# Altium schematic sheet Schematic.SchDoc
size A; SheetNumber: 1; SheetTotal: 1; SPICEModelCacheXZDIDKGW: <root> / <DocumentId>XZDIDKGW</DocumentId> / <CacheFrame Number="0"> / <Model Name="mcp6001" Kind="CKT"> / <Text>.SUBCKT MCP6001 1 2 3 4 5 / *               | | | | | / *               | | | | Output / *               | | | Negative Supply / *               | | Positive Supply / *               | Inverting Input / *               Non-inverting Input / * / ******************************************************************************** / * Software License Agreement                                                   * / *                                                                              * / * The software supplied herewith by Microchip Technology Incorporated (the     * / * "Company") is intended and supplied to you, the Company's customer, for use  * / * soley and exclusively on Microchip products.                                 * / *                                                                              * / * The software is owned by the Company and/or its supplier, and is protected   * / * under applicable copyright laws. All rights are reserved. Any use in         * / * violation of the foregoing restrictions may subject the user to criminal     * / * sanctions under applicable laws, as well as to civil liability for the       * / * breach of the terms and conditions of this license.                          * / *                                                                              * / * THIS SOFTWARE IS PROVIDED IN AN "AS IS" CONDITION. NO WARRANTIES, WHETHER    * / * EXPRESS, IMPLIED OR STATUTORY, INCLUDING, BUT NOT LIMITED TO, IMPLIED        * / * WARRANTIES OF MERCHANTABILITY AND FITNESS FOR A PARTICULAR PURPOSE APPLY TO  * / * THIS SOFTWARE. THE COMPANY SHALL NOT, IN ANY CIRCUMSTANCES, BE LIABLE FOR    * / * SPECIAL, INCIDENTAL OR CONSEQUENTIAL DAMAGES, FOR ANY REASON WHATSOEVER.     * / ******************************************************************************** / * / * Macromodel for the MCP6001/2/4 op amp family: / *   MCP6001, MCP6001R, MCP6001U, MCP6002, MCP6004 / * / * Revision History: / *   REV A: 21-Jun-02, Created model / *   REV B: 16-Jul-02, Improved output stage / *   REV C: 03-Jan-03, Added MCP6001 / *   REV D: 19-Aug-06, Added over temperature, improved output stage, / *                     fixed overdrive recovery time / *   REV E: 27-Jul-07, Updated output impedance for better model stability w/cap load / *   REV F: 09-Jul-12, Added MCP6001R, MCP6001U / * / * Recommendations: / *   Use PSPICE (other simulators may require translation) / *   For a quick, effective design, use a combination of: data sheet / *     specs, bench testing, and simulations with this macromodel / *   For high impedance circuits, set GMIN=100F in .OPTIONS / * / * Supported: / *   Typical performance for temperature range (-40 to 125) degrees Celsius / *   DC, AC, Transient, and Noise analyses. / *   Most specs, including: offsets, DC PSRR, DC CMRR, input impedance, / *     open loop gain, voltage ranges, supply current, ... , etc. / *   Temperature effects for Ibias, Iquiescent, Iout short circuit / *   current, Vsat on both rails, Slew Rate vs. Temp and P.S. / * / * Not Supported: / *   Some Variation in specs vs. Power Supply Voltage / *   Monte Carlo (Vos, Ib), Process variation / *   Distortion (detailed non-linear behavior) / *   Behavior outside normal operating region / * / * Input Stage / V10  3 10 -500M / R10 10 11 6.90K / R11 10 12 6.90K / C11 11 12 0.2p / C12 1  0 6.00P / E12 71 14 POLY(4) 20 0 21 0 26 0 27 0   1.00M 20.1 20.1 1 1 / G12 1 0 62 0 1m / M12 11 14 15 15 NMI L=2.00U W=42.0U / M14 12  2 15 15 NMI L=2.00U W=42.0U / G14 2 0 62 0 1m / C14  2  0 6.00P / I15 15  4 50.0U / V16 16  4 -300M / GD16 16 1 TABLE {V(16,1)} ((-100,-1p)(0,0)(1m,1n)(2m,1m)(3m,1)) / V13  3 13 -300M / GD13 2 13 TABLE {V(2,13)} ((-100,-1p)(0,0)(1m,1n)(2m,1m)(3m,1)) / R70 1 0 20.6T / R71 2 0 20.6T / R72 1 2 20T / I80 1 2 0.5p / * / * Noise, PSRR, and CMRR / I20 21 20 423U / D20 20  0 DN1 / D21  0 21 DN1 / G26  0 26 POLY(1) 3 4   110U -49U / R26 26  0 1 / G27  0 27 POLY(2) 1 0 2 0   -440U 39.7U 39.7U / R27 27  0 1 / * / * Open Loop Gain, Slew Rate / G30  0 30 POLY(1) 12 11   0 1 / R30 30  0 1K / G31  0 31 POLY(1) 3 4 86 5.25 / R31 31  0 1 TC=2.8m / GD31 30 31 TABLE {V(30,31)} ((-11,-1)(-10,-10n)(0,0)(1m,1000)) / G32 32  0 POLY(1) 3 4 113.7 3.5 / R32 32  0 1 TC=2.65m / GD32 30 32 TABLE {V(30,32)} ((-1m,-1000)(0,0)(10,10n)(11,1)) / G33 0 33 30 0 1m / R33 33 0 1k / G34  0 34 33 0 425M / R34  34 0 1K / C34  34 0 74U / G37  0 37 34 0 1m / R37  37 0 1K / C37  37 0 41.6P / G38  0 38 37 0 1m / R38  39 0 1K / L38  38 39 100U / E38  35 0 38 0 1 / G35 33 0 TABLE {V(35,3)} ((-1,-1n)(0,0)(16,1n))(16.1,1)) / G36 33 0 TABLE {V(35,4)} ((-16.1,-1)((-16,-1n)(0,0)(1,1n)) / * / * Output Stage / R80 50 0 100MEG / G50 0 50 57 96 2 / R58 57  96 0.50 / R57 57  0 750 / C58  5  0 2.00P / G57  0 57 POLY(3) 3 0 4 0 35 0   0 0.67M 0.67M 1.5M / GD55 55 57 TABLE {V(55,57)} ((-2m,-1)(-1m,-1m)(0,0)(10,1n)) / GD56 57 56 TABLE {V(57,56)} ((-2m,-1)(-1m,-1m)(0,0)(10,1n)) / E55 55  0 POLY(2) 3 0 51 0 -0.7m 1 -40.0M / E56 56  0 POLY(2) 4 0 52 0 1.2m 1 -37.0M / R51 51 0 1k / R52 52 0 1k / GD51 50 51 TABLE {V(50,51)} ((-10,-1n)(0,0)(1m,1m)(2m,1)) / GD52 50 52 TABLE {V(50,52)} ((-2m,-1)(-1m,-1m)(0,0)(10,1n)) / G53  3  0 POLY(1) 51 0  -49U 1M / G54  0  4 POLY(1) 52 0  -49U -1M / * / * Current Limit / G99 96 5 99 0 1 / R98 0 98 1 TC=-2.8M,2.63U / G97 0 98 TABLE { V(96,5) } ((-11.0,-10.0M)(-1.00M,-9.9M)(0,0)(1.00M,9.9M)(11.0,10.0M)) / E97 99 0 VALUE { V(98)*((V(3)-V(4))*359M + 310M)} / D98 4 5 DESD / D99 5 3 DESD / * / * Temperature / Voltage Sensitive IQuiscent / R61 0 61 100 TC 3.11M 4.51U / G61 3 4 61 0 1 / G60 0 61 TABLE {V(3, 4)} / + ((0,0)(900M,0.0106U)(1.00,0.20U)(1.3,0.63U) / + (1.5,0.66U)(1.6,1.06U)(5.5,1.10U)) / * / * Temp Sensitive offset voltage / I73 0 70 DC 1uA / R74 0 70 1 TC=2 / E75 1 71 70 0 1 / * / * Temp Sensistive IBias / I62 0 62 DC 1uA / R62 0 62 REXP 58.2u / * Voltage on R62 used for G12, G14 in input stage / * / * Models / .MODEL NMI NMOS / .MODEL DESD  D   N=1 IS=1.00E-15 / .MODEL DL  D   N=1 IS=1F / .MODEL DN1 D   IS=1P KF=146E-18 AF=1 / .MODEL REXP RES TCE=10.1 / .ENDS MCP6001</Text> / </Model> / </CacheFrame> / </root>
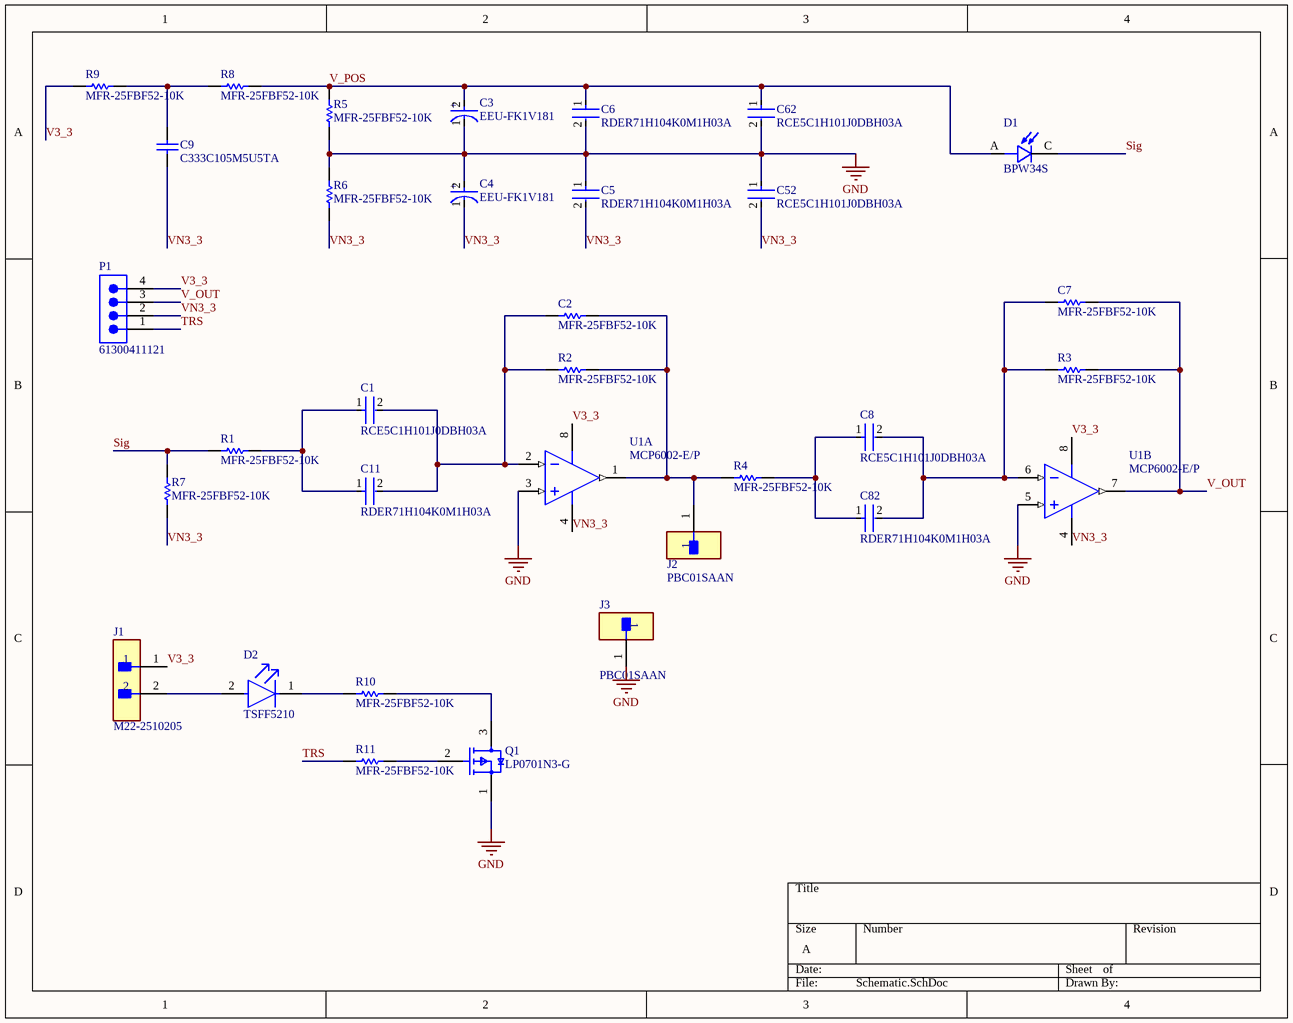
[diagram p0: Schematic.SchDoc]

## Parts
C1  RCE5C1H101J0DBH03A  [FP-RCE0DB-MFG]
C2  MFR-25FBF52-10K  [RESA60-630X240]
C3  EEU-FK1V181  [FP-RAD-TH-D_8_0_5-L_11_5-MFG]
C4  EEU-FK1V181  [FP-RAD-TH-D_8_0_5-L_11_5-MFG]
C5  RDER71H104K0M1H03A  [FP-RDE0M1-MFG]
C6  RDER71H104K0M1H03A  [FP-RDE0M1-MFG]
C7  MFR-25FBF52-10K  [RESA60-630X240]
C8  RCE5C1H101J0DBH03A  [FP-RCE0DB-MFG]
C9  C333C105M5U5TA  [KEMT-C333C105M5U5TA-2]
C11  RDER71H104K0M1H03A  [FP-RDE0M1-MFG]
C52  RCE5C1H101J0DBH03A  [FP-RCE0DB-MFG]
C62  RCE5C1H101J0DBH03A  [FP-RCE0DB-MFG]
C82  RDER71H104K0M1H03A  [FP-RDE0M1-MFG]
D1  BPW34S  [DIO_BPW34S]
D2  TSFF5210  [FP-6_544-5258_09-4-MFG]
J1  M22-2510205  [FP-M22-2510205-MFG]
J2  PBC01SAAN  [FP-PBC01SAAN-MFG]
J3  PBC01SAAN  [FP-PBC01SAAN-MFG]
P1  61300411121  [61300411121]
Q1  LP0701N3-G  [FP-N3-MFG]
R1  MFR-25FBF52-10K  [RESA60-630X240]
R2  MFR-25FBF52-10K  [RESA60-630X240]
R3  MFR-25FBF52-10K  [RESA60-630X240]
R4  MFR-25FBF52-10K  [RESA60-630X240]
R5  MFR-25FBF52-10K  [RESA60-630X240]
R6  MFR-25FBF52-10K  [RESA60-630X240]
R7  MFR-25FBF52-10K  [RESA60-630X240]
R8  MFR-25FBF52-10K  [RESA60-630X240]
R9  MFR-25FBF52-10K  [RESA60-630X240]
R10  MFR-25FBF52-10K  [RESA60-630X240]
R11  MFR-25FBF52-10K  [RESA60-630X240]
U1  MCP6002-E/P  [PDIP300-P8]  (parts A,B of 2)

## Nets
GND: C3.1(C) C4.2(A) C5.1 C6.2 C52.1 C62.2 J3.1 Q1.1(S) R5.1 R6.2 U1.3(VINA+) U1.5(VINB+)
Sig: D1.C R1.1 R7.2
TRS: P1.1 R11.1
V3_3: J1.1 P1.4 R9.1 U1.8(VDD)
V_OUT: C7.2 P1.3 R3.2 U1.7(VOUTB)
V_POS: C3.2(A) C6.1 C62.1 D1.A R5.2 R8.2
VN3_3: C4.1(C) C5.2 C9.1 C52.2 P1.2 R6.1 R7.1 U1.4(VSS)
NetC1_1: C1.1 C11.1 R1.2
NetC1_2: C1.2 C2.1 C11.2 R2.1 U1.2(VINA-)
NetC2_2: C2.2 J2.1 R2.2 R4.1 U1.1(VOUTA)
NetC7_1: C7.1 C8.2 C82.2 R3.1 U1.6(VINB-)
NetC8_1: C8.1 C82.1 R4.2
NetC9_2: C9.2 R8.1 R9.2
NetD2_1: D2.1(C) R10.1
NetD2_2: D2.2(A) J1.2
NetQ1_2: Q1.2(G) R11.2
NetQ1_3: Q1.3(D) R10.2

## Notes on the sheet
- (in symbol CMP-00030-00005-1) +

## Library data of the parts
C1 C8 C52 C62 = CMP-00030-00004-1: Ceramic Capacitor, Multilayer, Ceramic, 50V, 5% +Tol, 5% -Tol, C0G, 30ppm/Cel TC, 0.0001uF, Through Hole Mount, 1410; Reference Standard: AEC-Q200; Value: 100pF; Tolerance  (fill in as +-): 5%; Terminal Pitch: 2.5mm; Min Operating Temperature: -55°C; Width: 2.5mm; Capacitor Type: Ceramic; Packaging: Ammo Pack; Height: 3.5mm; Length: 3.6mm; Rated DC Voltage (URdc): 50V; Package Style: RadialMeter; Case/Package: 1410; Dielectric Material: Ceramic; RoHS Compliant: Yes; Max Operating Temperature: 125°C; Temperature Characteristics Code: C0G; Reach SVHC Compliant: Yes; Pins: 2; Tolerance (fill in as +-): 5%
C2 C7 R1-R11 = CMP-00030-00002-1: Fixed Resistor, Metal Film, 0.25W, 10000ohm, 250V, 1% +/-Tol, -100,100ppm/Cel; Lead Length: 28mm; Power: 250mW; Value: 10kR; Temperature Coefficient: -100100ppm/°C; Lead Diameter: 0.55mm; Package Length: 6.3mm; Pins: 2; JESD-609 Code: e3; Tolerance: 1%; Package Style: AXIAL; Max Operating Temperature: 155°C; RoHS Compliant: Yes; Packaging: Bulk; Construction: Cylindrical; Working Voltage: 250V; Technology: METAL FILM; Reach SVHC Compliant: Yes; Package Shape: Cylindrical; Min Operating Temperature: -55°C; Terminal Finish: Tin; Resistor Type: FIXED RESISTOR
C3 C4 = CMP-00030-00005-1: Aluminum Electrolytic Capacitor, Polarized, Aluminum (wet), 35V, 20% +Tol, 20% -Tol, 180uF, Through Hole Mount; Capacitor Type: Aluminium; Reference Standard: AEC-Q200; Leakage Current: 63uA; Ripple Current: 441mA; Tan Delta: 0.12; Max Operating Temperature: 105°C; Tolerance  (fill in as +-): 20%; Tolerance (fill in as +-): 20%; Min Operating Temperature: -55°C; Reach SVHC Compliant: Yes; Pins: 2; Polarity: Polarized; Rated DC Voltage (URdc): 35V; Terminal Pitch: 3.5mm; Packaging: Bulk; Value: 180uF; Package Style: RadialMeter; Dielectric Material: Aluminium; Length: 11.5mm; RoHS Compliant: Yes; Mounting Technology: Through Hole; Termination: Wire; Diameter: 8mm
C5 C6 C11 C82 = CMP-00030-00006-1: Ceramic Capacitor, Multilayer, Ceramic, 50V, 10% +Tol, 10% -Tol, X7R, 15% TC, 0.1uF, Through Hole Mount, 1610; Value: 100nF; Multilayer: Yes; Packaging: Ammo Pack; Case/Package: 1610; Tolerance (fill in as +-): 10%; Min Operating Temperature: -55°C; Terminal Pitch: 5mm; Tolerance  (fill in as +-): 10%; RoHS Compliant: Yes; Package Shape: Rectangular; Max Operating Temperature: 125°C; Package Style: RadialMeter; Dielectric Material: Ceramic; Length: 4mm; Reach SVHC Compliant: Yes; Mounting Technology: Through Hole; Capacitor Type: Ceramic; Height: 3.5mm; Termination: Wire; Pins: 2; Rated DC Voltage (URdc): 50V; Temperature Characteristics Code: X7R; Width: 2.5mm
C9 = CMP-00030-00003-1: Ceramic Capacitor, Multilayer, Ceramic, 50V, 20% +Tol, 20% -Tol, Z5U, -56/+22% TC, 1uF, Through Hole Mount; Multilayer: Yes; Rated DC Voltage (URdc): 50V; Tolerance  (fill in as +-): 20%; Reach SVHC Compliant: Yes; Packaging: Bulk; Max Operating Temperature: 85°C; Dielectric Material: Ceramic; Mounting Technology: Through Hole; Value: 1uF; Terminal Pitch: 5.08mm; JESD-609 Code: e3; Height: 9.91mm; RoHS Compliant: Yes; Min Operating Temperature: 10°C; Width: 3.81mm; Pins: 2; Terminal Finish: Nickel; Package Shape: Rectangular; Capacitor Type: Ceramic; Termination: Wire; Length: 7.62mm; Case/Package: 3015; Package Style: RadialMeter; Temperature Characteristics Code: Z5U; Tolerance (fill in as +-): 20%
D1 = BPW34S: Photodiode 850nm 20ns 120Â° 2-SMD, Gull Wing; MF: OSRAM Opto; Price: None; Package: DIP-2 Osram; MP: BPW34S; Value: *; Availability: Unavailable; SnapEDA_Link: https://www.snapeda.com/parts/BPW34S/OSRAM%20Opto%20Semiconductors%20Inc./view-part/253768/?ref=snap
D2 = CMP-00030-00011-1: Infrared LED, 5mm, 1-Element, 870nm; Output Power-Nom: 50mW; Forward Voltage: 1.8V; Shape: Round; Spectral Bandwidth: 4E-08nm; Additional Feature: HIGH RELIABILITY; Forward Current: 100mA; Semiconductor Material: GaAlAs; Channels: 1; Viewing Angle: 20°; Reverse Voltage-Max: 5V; Optoelectronic Device Type: INFRARED LED; RoHS Compliant: Yes; Reach SVHC Compliant: Yes; JESD-609 Code: e3; Mounting Technology: Through Hole; Size: 5mm; Min Operating Temperature: -40°C; Max Operating Temperature: 85°C; Terminal Finish: Tin
J1 = CMP-00030-00010-1: Board Connector, 2 Contact(s), 1 Row(s), Male, Straight, 0.079 inch Pitch, Solder Terminal, Black Insulator, Plug; Additional Feature: ROHS COMPLIANT; Number of Rows Loaded: 1; Number of Contacts: 2; Reliability: COMMERCIAL; PCB Contact Pattern: RECTANGULAR; Body Depth: 0.059inch; Reference Standard: UL; IEC Conformance: No; Contact Resistance: 20mR; Dielectric Withstanding Voltage (AC): 650V; Option: General Purpose; Durability: 300Cycles; Rated Current (Signal): 1A; Contact Style: SQ PIN-SKT; Mating Information: MULTIPLE MATING PARTS AVAILABLE; Insulation Resistance: 100MR; Contact Gender: Male; Mounting Technology: Board; Contact Finish - Termination: Gold (Au) - with Nickel (Ni) barrier; Terminal Pitch: 2mm; Reach SVHC Compliant: Yes; Min Operating Temperature: -55°C; Termination: Solder; Max Operating Temperature: 105°C; Body/Shell Style: PLUG; Mating Contact Pitch: 0.079inch; Number Of Connectors: 1; Insulation Color: Black; Flammability Rating: UL94 V-0; Filter Feature: No; RoHS Compliant: Yes; Body Breadth: 0.079inch; Contact Finish - Mating: GOLD; Contact Pattern: RECTANGULAR; DIN Conformance: No; Mixed Contacts: No; JESD-609 Code: e4; Connector Type: BOARD CONNECTOR; MIL Conformance: No; Insulation Material: Nylon; Mounting Style: STRAIGHT; Terminal Length: 0.091inch; Number Of PCB Rows: 1
J2 J3 = CMP-00030-00009-1: Board Connector, 1 Contact(s), 1 Row(s), Male, Straight, 0.1 inch Pitch, Solder Terminal; Contact Style: SQ PIN-SKT; Number Of PCB Rows: 1; Rated Current (Signal): 3A; Reliability: COMMERCIAL; Plating Thickness: 10uin; Contact Pattern: RECTANGULAR; Reference Standard: UL; Max Operating Temperature: 125°C; Mounting Style: STRAIGHT; Contact Finish - Mating: AU ON NI; JESD-609 Code: e3; Terminal Length: 0.12inch; Contact Finish - Termination: Matte Tin (Sn) - with Nickel (Ni) barrier; Terminal Pitch: 2.54mm; Connector Type: BOARD CONNECTOR; Body Breadth: 0.1inch; Number Of Connectors: 1; RoHS Compliant: Yes; Body Length: 0.1inch; Body Depth: 0.1inch; Contact Gender: Male; Insulation Material: Polybutylene; Number of Rows Loaded: 1; Number of Contacts: 1; Manufacturer Series: PBC01SAAN; Mounting Technology: Board; Reach SVHC Compliant: Yes; Min Operating Temperature: -65°C; Termination: Solder; Contact Material: Bronze; Mating Contact Pitch: 0.1inch
P1 = CMP-00030-00012-1: Board Connector, 4 Contact(s), 1 Row(s), Male, Straight, 0.1 inch Pitch, Solder Terminal, Locking, Black Insulator, Plug; Number of Contacts: 4; PCB Contact Pattern: RECTANGULAR; Reliability: COMMERCIAL; Contact Resistance: 20mR; Body Length: 0.4inch; Reference Standard: UL; Dielectric Withstanding Voltage (AC): 500V; Rated Current (Signal): 3A; Contact Style: SQ PIN-SKT; Number Of Connectors: 1; Insulation Resistance: 1GR; Mounting Option 1: LOCKING; Connector Type: BOARD CONNECTOR; Mounting Style: STRAIGHT; Terminal Length: 0.118inch; Contact Finish - Termination: Gold (Au) - with Nickel (Ni) barrier; Contact Gender: Male; Mounting Technology: Board; Terminal Pitch: 2.54mm; Body Breadth: 0.1inch; Contact Pattern: RECTANGULAR; Insulation Color: Black; Mating Contact Pitch: 0.1inch; Body Depth: 0.1inch; Max Operating Temperature: 125°C; JESD-609 Code: e4; Body/Shell Style: PLUG; Contact Material: Copper Alloy; Min Operating Temperature: -40°C; Reach SVHC Compliant: Yes; Termination: Solder; RoHS Compliant: Yes; Insulation Material: Polybutylene; Number of Rows Loaded: 1; Contact Finish - Mating: GOLD
Q1 = CMP-00030-00008-1: Mosfet; P-channel Enhancement-mode; -16.5V; 1.5 OHM3 TO-92BAG
U1 = CMP-00030-00007-1: Operational Amplifier, 2 Func, 4500uV Offset-Max, CMOS, PDIP8; Slew Rate: 0.6V/µs; Package Body Material: Plastic; Input Offset Voltage-Max: 4.5mV; Common-mode Reject Ratio-Nom: 76dB; Frequency Compensation: YES; Qualification Status: Not Qualified; Architecture: VOLTAGE-FEEDBACK; Low-Bias: No; Max Supply Current: 340uA; Surface Mount: No; Supply Voltage Limit-Max: 7V; Voltage Gain-Min: 25110; Power Supplies: 2.5V; Unity Gain BW-Nom: 1MHz; Package Equivalence Code: SOLCC8,.11,20; Channels: 2; Nominal Supply Voltage: 5V; Terminal Pitch: 2.54mm; Min Operating Temperature: -40°C; Terminal Position: DUAL; Length: 9.271mm; Amplifier Type: OPERATIONAL AMPLIFIER; RoHS Compliant: Yes; Width: 7.62mm; Pins: 8; Package Style: IN-LINEMeter; Package Shape: Rectangular; JESD-30 Code: R-PDIP-T8; Low-Offset: No; Wideband: No; Height - Seated (Max): 5.33mm; Max Operating Temperature: 125°C; Case/Package: DIP; Technology: CMOS; Micropower: Yes; Reach SVHC Compliant: Yes; Terminal Finish: Tin; Terminal Form: Through Hole; JESD-609 Code: e3; Programmable Power: No; Temperature Grade: AUTOMOTIVE; Power: No